# EAGLE design Mergen Ground Station_V2.0 (EAGLE 9.6.2)
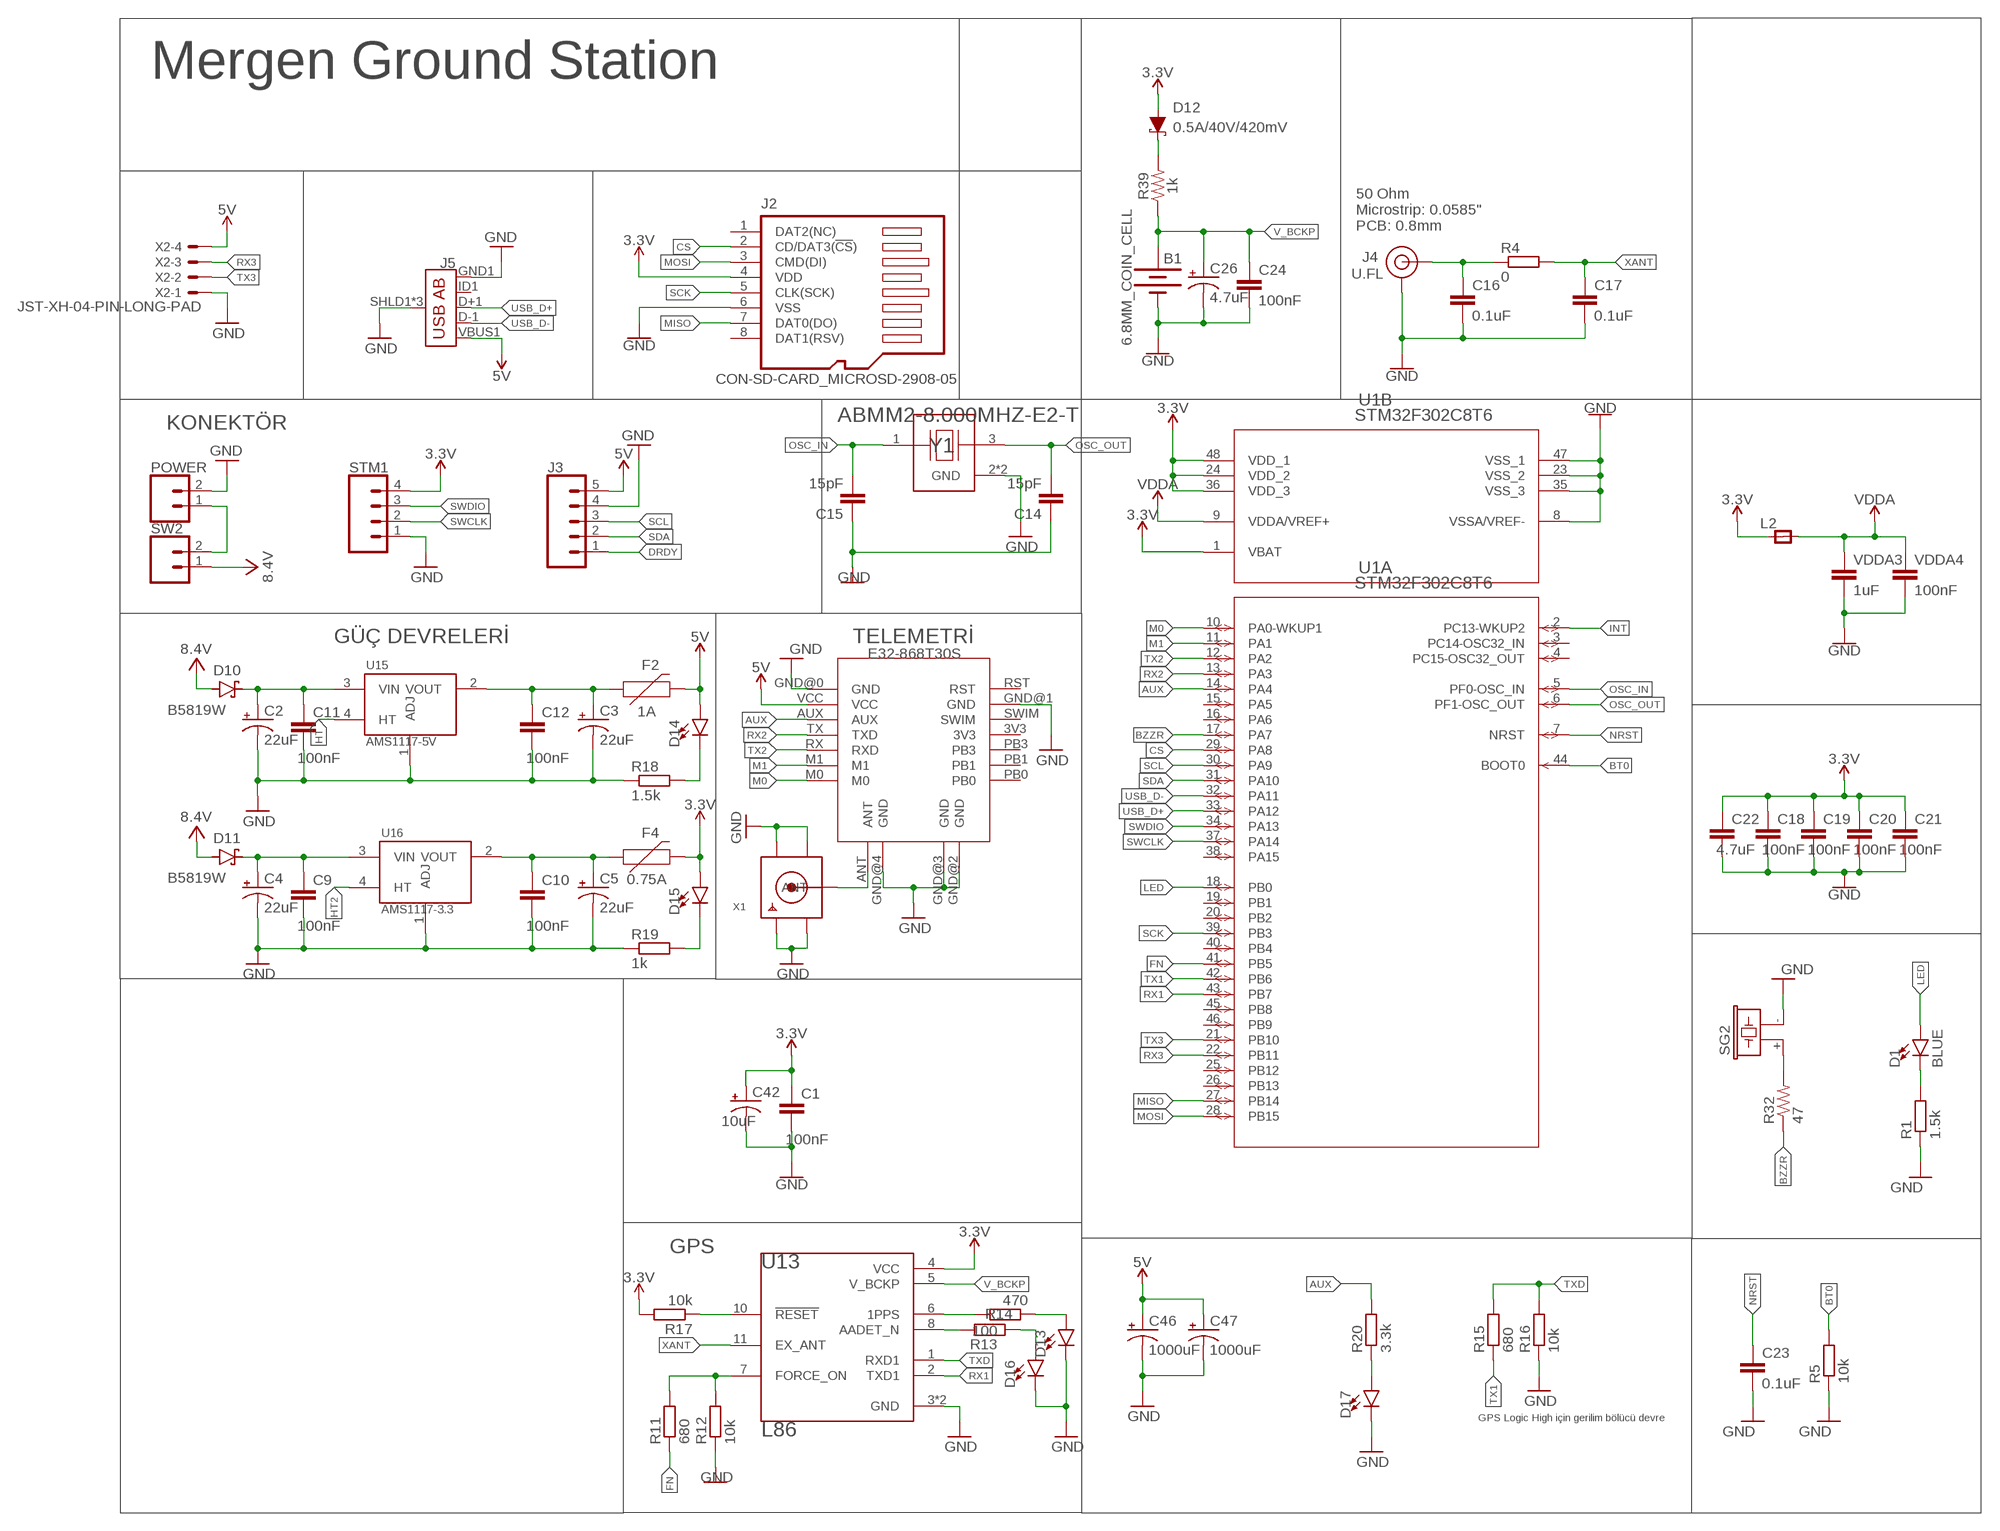
[diagram p0: schematic, sheet 1]

## Parts
B1  6.8MM_COIN_CELL  BATTERY-6.8MM_SMD  [BATTCON-6.8MM]
C1  100nF  C-EUC0603  [C0603]
C2  22uF  CPOL-USCT3528  [CT3528]
C3  22uF  CPOL-USCT3528  [CT3528]
C4  22uF  CPOL-USCT3528  [CT3528]
C5  22uF  CPOL-USCT3528  [CT3528]
C9  100nF  C-EUC0603  [C0603]
C10  100nF  C-EUC0603  [C0603]
C11  100nF  C-EUC0603  [C0603]
C12  100nF  C-EUC0603  [C0603]
C14  15pF  C-EUC0603  [C0603]
C15  15pF  C-EUC0603  [C0603]
C16  0.1uF  C-EUC0603  [C0603]
C17  0.1uF  C-EUC0603  [C0603]
C18  100nF  C-EUC0603  [C0603]
C19  100nF  C-EUC0603  [C0603]
C20  100nF  C-EUC0603  [C0603]
C21  100nF  C-EUC0603  [C0603]
C22  4.7uF  C-EUC0603  [C0603]
C23  0.1uF  C-EUC0603  [C0603]
C24  100nF  C-EUC0603  [C0603]
C26  4.7uF  CPOL-USA/3216-18R  [A/3216-18R]
C42  10uF  10UF-POLAR-EIA3216-16V-10%(TANT)  [EIA3216]
C46  1000uF  CPOL-US150CLZ-1010  [150CLZ-1010]
C47  1000uF  CPOL-US150CLZ-1010  [150CLZ-1010]
D1  BLUE  LED0603  [LED-0603]
D10  B5819W  SCHOTTKY_MBR0520LT1GDO-219  [SODFL3718X115]
D11  B5819W  SCHOTTKY_MBR0520LT1GDO-219  [SODFL3718X115]
D12  0.5A/40V/420mV  DIODE-SCHOTTKY-PMEG4005EJ  [SOD-323]
D13  LED0603  [LED-0603]
D14  LED0603  [LED-0603]
D15  LED0603  [LED-0603]
D16  LED0603  [LED-0603]
D17  LED0603  [LED-0603]
F2  1A  PPTC_HALF-AMP  [1206]
F4  0.75A  PPTC_HALF-AMP  [1206]
J2  CON-SD-CARD_MICROSD-2908-05  [CON-SD-CARD_2908-05]
J3  CONN_05LOCK_LONGPADS  [1X05_LOCK_LONGPADS]
J4  U.FL  U.FL2PIN  [U.FL]
J5  USB_AB_SMT  [USB-AB-MICRO-SMD]
L2  RC-MASTER-SMD_FB_0805MP  [RC-MASTER-SMD_L0805MP]
POWER  CONN_023.5MM-NO_SILK  [SCREWTERMINAL-3.5MM-2-NS]
R1  1.5k  R-EU_R0603  [R0603]
R4  0  R-EU_R0603  [R0603]
R5  10k  R-EU_R0603  [R0603]
R11  680  R-EU_R0603  [R0603]
R12  10k  R-EU_R0603  [R0603]
R13  100  R-EU_R0603  [R0603]
R14  470  R-EU_R0603  [R0603]
R15  680  R-EU_R0603  [R0603]
R16  10k  R-EU_R0603  [R0603]
R17  10k  R-EU_R0603  [R0603]
R18  1.5k  R-EU_R0603  [R0603]
R19  1k  R-EU_R0603  [R0603]
R20  3.3k  R-EU_R0603  [R0603]
R32  47  0OHM-0603-1/10W-5%  [0603]
R39  1k  1KOHM-0603-1/10W-1%  [0603]
SG2  F/CM12P  [F/CM12P]
STM1  CONN_04  [1X04]
SW2  CONN_023.5MM-NO_SILK  [SCREWTERMINAL-3.5MM-2-NS]
U1  STM32F302C8T6  [LQFP48-7X7MM]
U13  L86  [XCVR_L86]
U14  E32-868T30S  [E32-868T30S]
U15  AMS1117-5V  AMS1117-3.3  [SOT229P700X180-4N]
U16  AMS1117-3.3  [SOT229P700X180-4N]
VDDA3  1uF  0.1UF-0603-25V-(+80/-20%)  [0603]
VDDA4  100nF  0.1UF-0603-25V-(+80/-20%)  [0603]
X1  SMACONNECTOR  [SMA90_DIP]
X2  JST-XH-04-PIN-LONG-PAD  [JST-XH-04-PACKAGE-LONG-PAD]
Y1  ABMM2-8.000MHZ-E2-T  [XTAL_ABMM2-8.000MHZ-E2-T]

## Nets
3.3V: C1.1 C18.1 C19.1 C20.1 C21.1 C22.1 C42.+ D12.A D15.A F4.2 J2.4(VDD) L2.1 R17.2 STM1.4 U1.1(B:VBAT) U1.24(B:VDD_2) U1.36(B:VDD_3) U1.48(B:VDD_1) U13.4(VCC)
5V: C46.+ C47.+ D14.A F2.2 J3.5 J5.VBUS1(VBUS) U14.VCC X2.4
AUX: R20.2 U1.14(A:PA4) U14.AUX
BT0: R5.2 U1.44(A:BOOT0)
BZZR: R32.1 U1.17(A:PA7)
CS: J2.2(CD/DAT3(!CS!)) U1.29(A:PA8)
DRDY: J3.1
FN: R11.1 U1.41(A:PB5)
GND: B1.- C1.2 C2.- C3.- C4.- C5.- C9.2 C10.2 C11.2 C12.2 C14.1 C15.1 C16.2 C17.2 C18.2 C19.2 C20.2 C21.2 C22.2 C23.2 C24.2 C26.- C42.- C46.- C47.- D13.C D16.C D17.C J2.6(VSS) J3.4 J4.1(GND) J4.2(GND) J5.GND1(GND) J5.SHLD1(SHIELD) J5.SHLD2(SHIELD) J5.SHLD3(SHIELD) POWER.2 R1.1 R5.1 R12.1 R16.1 R18.1 R19.1 SG2.- STM1.1 U1.8(B:VSSA/VREF-) U1.23(B:VSS_2) U1.35(B:VSS_3) U1.47(B:VSS_1) U13.3(GND) U13.12(GND) U14.GND@0(GND) U14.GND@1(GND) U14.GND@2(GND) U14.GND@3(GND) U14.GND@4(GND) U15.1(ADJ) U16.1(ADJ) VDDA3.2 VDDA4.2 X1.GND1 X1.GND2 X1.GND3 X1.GND4 X2.1 Y1.2(GND) Y1.4(GND)
HT: U15.4(HT)
HT2: U16.4(HT)
INT: U1.2(A:PC13-WKUP2)
LED: D1.A U1.18(A:PB0)
M0: U1.10(A:PA0-WKUP1) U14.M0
M1: U1.11(A:PA1) U14.M1
MISO: J2.7(DAT0(DO)) U1.27(A:PB14)
MOSI: J2.3(CMD(DI)) U1.28(A:PB15)
N$1: D1.C R1.2
N$2: D16.A R13.1
N$22: C2.+ C11.1 D10.1(C) U15.3(VIN)
N$23: C3.+ C12.1 F2.1 U15.2(VOUT)
N$24: C4.+ C9.1 D11.1(C) U16.3(VIN)
N$25: C5.+ C10.1 F4.1 U16.2(VOUT)
N$27: U14.ANT X1.ANTENNA(ANT)
N$28: R32.2 SG2.+
N$30: POWER.1 SW2.2
N$31: D12.C R39.2
N$32: R17.1 U13.10(!RESET)
N$33: R14.2 U13.6(1PPS)
N$34: D13.A R14.1
N$35: D14.C R18.2
N$36: D15.C R19.2
N$37: R13.2 U13.8(AADET_N)
N$39: C16.1 J4.FEED(SIGNAL) R4.1
N$40: R11.2 R12.2 U13.7(FORCE_ON)
N$41: D17.A R20.1
NRST: C23.1 U1.7(A:NRST)
OSC_IN: C15.2 U1.5(A:PF0-OSC_IN) Y1.1
OSC_OUT: C14.2 U1.6(A:PF1-OSC_OUT) Y1.3
RX1: U1.43(A:PB7) U13.2(TXD1)
RX2: U1.13(A:PA3) U14.TX(TXD)
RX3: U1.22(A:PB11) X2.3
SCK: J2.5(CLK(SCK)) U1.39(A:PB3)
SCL: J3.3 U1.30(A:PA9)
SDA: J3.2 U1.31(A:PA10)
SWCLK: STM1.2 U1.37(A:PA14)
SWDIO: STM1.3 U1.34(A:PA13)
TX1: R15.1 U1.42(A:PB6)
TX2: U1.12(A:PA2) U14.RX(RXD)
TX3: U1.21(A:PB10) X2.2
TXD: R15.2 R16.2 U13.1(RXD1)
USB_D+: J5.D+1(D+) U1.33(A:PA12)
USB_D-: J5.D-1(D-) U1.32(A:PA11)
V_BCKP: B1.+ C24.1 C26.+ R39.1 U13.5(V_BCKP)
VCC: D10.2(A) D11.2(A) SW2.1 ; supply symbol labelled 8.4V
VDDA: L2.2 U1.9(B:VDDA/VREF+) VDDA3.1 VDDA4.1
XANT: C17.1 R4.2 U13.11(EX_ANT)
Unconnected: J2.1(DAT2(NC)) J2.8(DAT1(RSV)) J2.GND@1(GND) J2.GND@2(GND) J2.GND@3(GND) J2.GND@4(GND) J5.ID1(USBID) U1.3(A:PC14-OSC32_IN) U1.4(A:PC15-OSC32_OUT) U1.15(A:PA5) U1.16(A:PA6) U1.19(A:PB1) U1.20(A:PB2) U1.25(A:PB12) U1.26(A:PB13) U1.38(A:PA15) U1.40(A:PB4) U1.45(A:PB8) U1.46(A:PB9) U14.3V3 U14.PB0 U14.PB1 U14.PB3 U14.RST U14.SWIM

## Notes on the sheet
- Mergen Ground Station
- 50 Ohm 
  Microstrip: 0.0585"
  PCB: 0.8mm
- KONEKTÖR
- GÜÇ DEVRELERİ | TELEMETRİ
- GPS
- GPS Logic High için gerilim bölücü devre

## Library data of the parts
B1 = SparkFun-Batteries:BATTERY: Battery - Single Cell A variety of battery chemistries, sizes, and footprints. Device List: 20MM_PTH - Coin Cell Battery Holder - 20mm (PTH) <https://www.sparkfun.com/products/783> 6.8MM_PTH - Coin Cell Battery Holder - 6.8MM(SMD) <https://www.digikey.com/product-detail/en/seiko-instruments/MS621FE-FL11E/728-1057-ND/1889208?WT.srch=1&gclid=CNOQ5a6LzdQCFZS2wAodXCkE0g> 12MM_SMD - Coin Cell Battery Holder - 12mm (SMD) <https://www.sparkfun.com/products/10592> 12MM_PTH - Coin Cell Battery Holder - 12mm (PTH) <https://www.sparkfun.com/products/7948> 20MM_SMD - 20mm Coin Cell Battery Holder (SMD) (2 legs) Used on the Big Time Watch Kit <https://www.sparkfun.com/products/11734> 20MM_SMD_4LEGS - Coin Cell Battery Holder - 20mm (SMD) <https://www.sparkfun.com/products/11892> 20MM_SMD_4LEGS_OVERPASTE - Coin Cell Battery Holder - 20mm (SMD) <https://www.sparkfun.com/products/11892> (Over-paste on the legs) 24.5MM_PTH - Coin Cell Battery Holder - 24.5mm (PTH) <https://www.sparkfun.com/products/8863> 9V - 9V Battery Holder - PC Mount Used on the SparkFun SparkPunk Sound Kit <https://www.sparkfun.com/products/11177> and SparkFun SparkPunk Sequencer Kit <https://www.sparkfun.com/products/12707> 18650 - Battery Holder - 18650 (PTH) <https://www.sparkfun.com/products/13113> AA - Battery Holder - 1xAA (PTH) <https://www.sparkfun.com/products/7949> AAA - Battery Holder - 1xAAA (PTH) <https://www.sparkfun.com/products/12718> AA_KIT - Battery Holder - 1xAA (PTH) <https://www.sparkfun.com/products/7949> Special kit package - pads only have exposed copper on one side of the board. AAA_KIT - Battery Holder - 1xAAA (PTH) <https://www.sparkfun.com/products/12718> Special kit package - pads only have exposed copper on one side of the board.; PROD_ID: BATT-13734
C1 C9-C12 C14-C24 = rcl:C-EU: CAPACITOR, European symbol; SPICEPREFIX: C
C2-C5 C26 = rcl:CPOL-US: POLARIZED CAPACITOR, American symbol; SPICEPREFIX: C
C42 = SparkFun-Capacitors:10UF-POLAR: 10.0µF polarized capacitors A capacitor is a passive two-terminal electrical component used to store electrical energy temporarily in an electric field.; PROD_ID: CAP-00811
C46 C47 = adafruit:CPOL-US: POLARIZED CAPACITOR, American symbol
D1 D13-D17 = SparkFun-LED:LED: LED (Generic) Standard schematic elements and footprints for 5mm, 3mm, 1206, and 0603 sized LEDs. Generic LEDs with no color specified.
D10 D11 = Diode:SCHOTTKY_: Schottky Diode - Popular parts; CATEGORY: Diode; DESCRIPTION: DIODE SCHOTTKY 20V 500MA SOD123; MANUFACTURER: ON Semiconductor; MPN: MBR0520LT1G; SUB-CATEGORY: Schottky; VALUE: MBR0520LT1G
D12 = SparkFun-DiscreteSemi:DIODE-SCHOTTKY: Schottky diode A Schottky diode is a semiconductor diode which has a low forward voltage drop and a very fast switching action.; PROD_ID: DIO-10955
F2 F4 = SparkFun-Fuses:PPTC: Resettable Fuse PPTC Resettable Fuse. Really a sort of resistor with a polymeric positive temperature coefficient whose resistance increases dramatically with an increase in temperature. When heated by the power passing through the resistance rises causing the current to be limited, protecting the circuit. This is achieved by the transition of the polymer from a crystalline to an amorphous state where the conductive carbon separates breaking the conductive pathways found in the cool crystalline structure. When a PPTC cools back down it resumes conducting letting the circuit turn back on. SparkFun Products: SparkFun RedBoard - Programmed with Arduino <https://www.sparkfun.com/products/12757> Pro Micro - 5V/16MHz <https://www.sparkfun.com/products/12640> Arduino Pro 328 - 5V/16MHz <https://www.sparkfun.com/products/10915> MP3 Trigger <https://www.sparkfun.com/products/13720>; PROD_ID: RES-08585; VALUE: 6V/0.5A
J2 = 52101-101-REV-A_v16:CON-SD-CARD_MICROSD-: microSD Connector
J3 = SparkFun-Connectors:CONN_05: Multi connection point. Often used as Generic Header-pin footprint for 0.1 inch spaced/style header connections On any of the 0.1 inch spaced packages, you can populate with these: Break Away Headers - Straight <https://www.sparkfun.com/products/116> (PRT-00116) Break Away Male Headers - Right Angle <https://www.sparkfun.com/products/553> (PRT-00553) Female Headers <https://www.sparkfun.com/products/115> (PRT-00115) Break Away Headers - Machine Pin <https://www.sparkfun.com/products/117> (PRT-00117) Break Away Female Headers - Swiss Machine Pin <https://www.sparkfun.com/products/743> (PRT-00743) For SCREWTERMINALS and SPRING TERMINALS visit here: Screw Terimnals on SparkFun.com <https://www.sparkfun.com/search/results?term=Screw+Terminals> (5mm/3.5mm/2.54mm spacing) This device is also useful as a general connection point to wire up your design to another part of your project. Our various solder wires solder well into these plated through hole pads. Hook-Up Wire - Assortment (Stranded, 22 AWG) <https://www.sparkfun.com/products/11375> (PRT-11375) Hook-Up Wire - Assortment (Solid Core, 22 AWG) <https://www.sparkfun.com/products/11367> (PRT-11367) View the entire wire category on our website here <https://www.sparkfun.com/categories/141> Special notes: Molex polarized connector foot print use with SKU : PRT-08231 with associated crimp pins and housings. 1MM SMD Version SKU: PRT-10208
J4 = SparkFun-Connectors:U.FL2PIN: SMD Antenna Connector - U.FL 2mm height, 3.0mm x 3.0mm receptacle size. SparkFun Products: SparkFun WiFi Shield - ESP8266 <https://www.sparkfun.com/products/13287> SparkFun ESP8266 Thing <https://www.sparkfun.com/products/13231> SparkFun MiniGen - Pro Mini Signal Generator Shield <https://www.sparkfun.com/products/11420>; PROD_ID: CONN-09193; SF_ID: WRL-09144
J5 = SparkFun-Connectors:USB_AB: USB Type AB Micro Connector OTG-compatible. 5 pins, 3 shield pins SparkFun Products: IOIO-OTG <https://www.sparkfun.com/products/13613> SparkFun SAMD21 Mini Breakout <https://www.sparkfun.com/products/13664>; PROD_ID: CONN-11794
L2 = 52101-101-REV-A_v16:RC-MASTER-SMD_FB_: FERRITE BEAD
POWER SW2 = SparkFun-Connectors:CONN_02: Multi connection point. Often used as Generic Header-pin footprint for 0.1 inch spaced/style header connections On any of the 0.1 inch spaced packages, you can populate with these: Break Away Headers - Straight <https://www.sparkfun.com/products/116> (PRT-00116) Break Away Male Headers - Right Angle <https://www.sparkfun.com/products/553> (PRT-00553) Female Headers <https://www.sparkfun.com/products/115> (PRT-00115) Break Away Headers - Machine Pin <https://www.sparkfun.com/products/117> (PRT-00117) Break Away Female Headers - Swiss Machine Pin <https://www.sparkfun.com/products/743> (PRT-00743) For SCREWTERMINALS and SPRING TERMINALS visit here: Screw Terimnals on SparkFun.com <https://www.sparkfun.com/search/results?term=Screw+Terminals> (5mm/3.5mm/2.54mm spacing) This device is also useful as a general connection point to wire up your design to another part of your project. Our various solder wires solder well into these plated through hole pads. Hook-Up Wire - Assortment (Stranded, 22 AWG) <https://www.sparkfun.com/products/11375> (PRT-11375) Hook-Up Wire - Assortment (Solid Core, 22 AWG) <https://www.sparkfun.com/products/11367> (PRT-11367) View the entire wire category on our website here <https://www.sparkfun.com/categories/141> Special notes: Molex polarized connector foot print use with: PRT-08233 with associated crimp pins and housings. 2.54_SCREWTERM for use with PRT-10571. 3.5mm Screw Terminal footprints for PRT-08084 5mm Screw Terminal footprints for use with PRT-08432; PROD_ID: CONN-08399
R1 R4 R5 R11-R20 = rcl:R-EU_: RESISTOR, European symbol; SPICEPREFIX: R
R32 = SparkFun-Resistors:0OHM: 0Ω resistor A resistor is a passive two-terminal electrical component that implements electrical resistance as a circuit element. Resistors act to reduce current flow, and, at the same time, act to lower voltage levels within circuits. - Wikipedia; PROD_ID: RES-08609; VALUE: 0
R39 = SparkFun-Resistors:1KOHM: 1kΩ resistor A resistor is a passive two-terminal electrical component that implements electrical resistance as a circuit element. Resistors act to reduce current flow, and, at the same time, act to lower voltage levels within circuits. - Wikipedia; PROD_ID: RES-07856
SG2 = buzzer:F/CM12P: BUZZER Source: Buerklin; OC_FARNELL: unknown; OC_NEWARK: unknown
STM1 = SparkFun-Connectors:CONN_04: Multi connection point. Often used as Generic Header-pin footprint for 0.1 inch spaced/style header connections On any of the 0.1 inch spaced packages, you can populate with these: Break Away Headers - Straight <https://www.sparkfun.com/products/116> (PRT-00116) Break Away Male Headers - Right Angle <https://www.sparkfun.com/products/553> (PRT-00553) Female Headers <https://www.sparkfun.com/products/115> (PRT-00115) Break Away Headers - Machine Pin <https://www.sparkfun.com/products/117> (PRT-00117) Break Away Female Headers - Swiss Machine Pin <https://www.sparkfun.com/products/743> (PRT-00743) For SCREWTERMINALS and SPRING TERMINALS visit here: Screw Terimnals on SparkFun.com <https://www.sparkfun.com/search/results?term=Screw+Terminals> (5mm/3.5mm/2.54mm spacing) This device is also useful as a general connection point to wire up your design to another part of your project. Our various solder wires solder well into these plated through hole pads. Hook-Up Wire - Assortment (Stranded, 22 AWG) <https://www.sparkfun.com/products/11375> (PRT-11375) Hook-Up Wire - Assortment (Solid Core, 22 AWG) <https://www.sparkfun.com/products/11367> (PRT-11367) View the entire wire category on our website here <https://www.sparkfun.com/categories/141> Special notes: Molex polarized connector foot print use with SKU : PRT-08231 with associated crimp pins and housings. 1MM SMD Version SKU: PRT-10208; PROD_ID: CONN-09696
U1 = STM32F302C8T6:STM32F302C8T6; BUILT_BY: EMA_UL_Team; COPYRIGHT: Copyright (C) 2018 Accelerated Designs. All rights reserved; MANUFACTURER_PART_NUMBER: STM32F302C8T6; SOURCELIBRARY: Updates_to_database_2020-10-19; VENDOR: STMicroelectronics
U13 = L86:L86: L86 is an ultra-compact GNSS POT (Patch on Top) module with an embedded 18.4mm × 18.4mm × 4.0mm patch antenna and utilizes the MediaTek new generation GNSS chipset MT3333 that achieves the perfect performance; AVAILABILITY: Unavailable; DESCRIPTION: L86 is an ultra-compact GNSS POT (Patch on Top) module with an embedded 18.4mm × 18.4mm × 4.0mm patch antenna and utilizes the MediaTek new generation GNSS chipset MT3333 that achieves the perfect performance; MF: Quectel; MP: L86; PACKAGE: PowerSFN-8 Quectel; PRICE: None
U14 = E32-868T30S:E32-868T30S: E BYTE E32-868T30S
U15 U16 = AMS1117-3.3:AMS1117-3.3: Sot223/Pkg 1-Amp 3.3-Volt Low Drop Out Voltage Regulatator; AVAILABILITY: Unavailable; DESCRIPTION: Sot223/Pkg 1-Amp 3.3-Volt Low Drop Out Voltage Regulatator; MF: Advanced Monolithic Systems; MP: AMS1117-3.3; PACKAGE: SOT-89 ams; PRICE: None
VDDA3 VDDA4 = SparkFun-Capacitors:0.1UF: 0.1µF ceramic capacitors A capacitor is a passive two-terminal electrical component used to store electrical energy temporarily in an electric field.; PROD_ID: CAP-00810; VALUE: 0.1uF
X1 = adafruit:SMACONNECTOR: SMA Connector 90° DIP SMA Connector, 50 Ohm (4UConnector: 07259)
X2 = Rembrandt Electronics - JST XH Connectors v1-0:JST-XH-04-PIN: JST XH Connector 2 Pin Wire to board connector. Pitch: 2,54 mm, (0.100") Number of pins: 4 Created by Rembrandt Electronics www.rembrandtelectronics.com
Y1 = ABMM2-8.000MHZ-E2-T (1):ABMM2-8.000MHZ-E2-T: Check prices <https://pricing.snapeda.com/parts/ABMM2-8.000MHZ-E2-T/Abracon/view-part?ref=eda>; AVAILABILITY: Good; DESCRIPTION: 8MHz ±20ppm Crystal 18pF 72 Ohms 4-SMD, No Lead; MF: Abracon; MP: ABMM2-8.000MHZ-E2-T; PACKAGE: SMD-4 Abracon; PRICE: None; PURCHASE-URL: https://pricing.snapeda.com/search/part/ABMM2-8.000MHZ-E2-T/?ref=eda

## Board
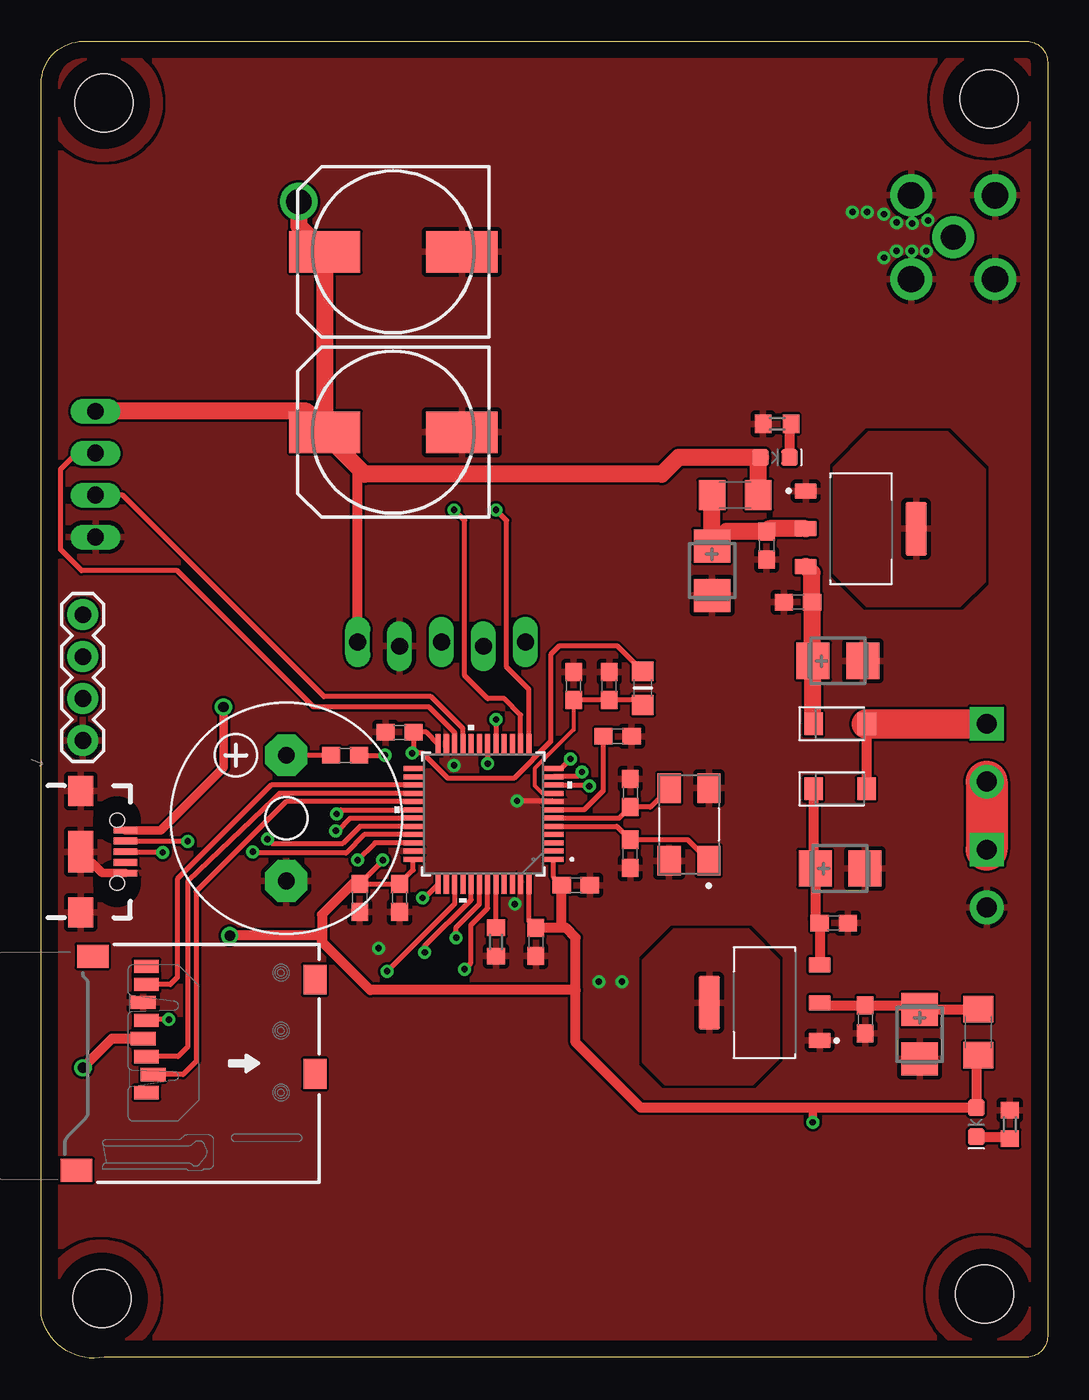
[diagram p1: board, top side]
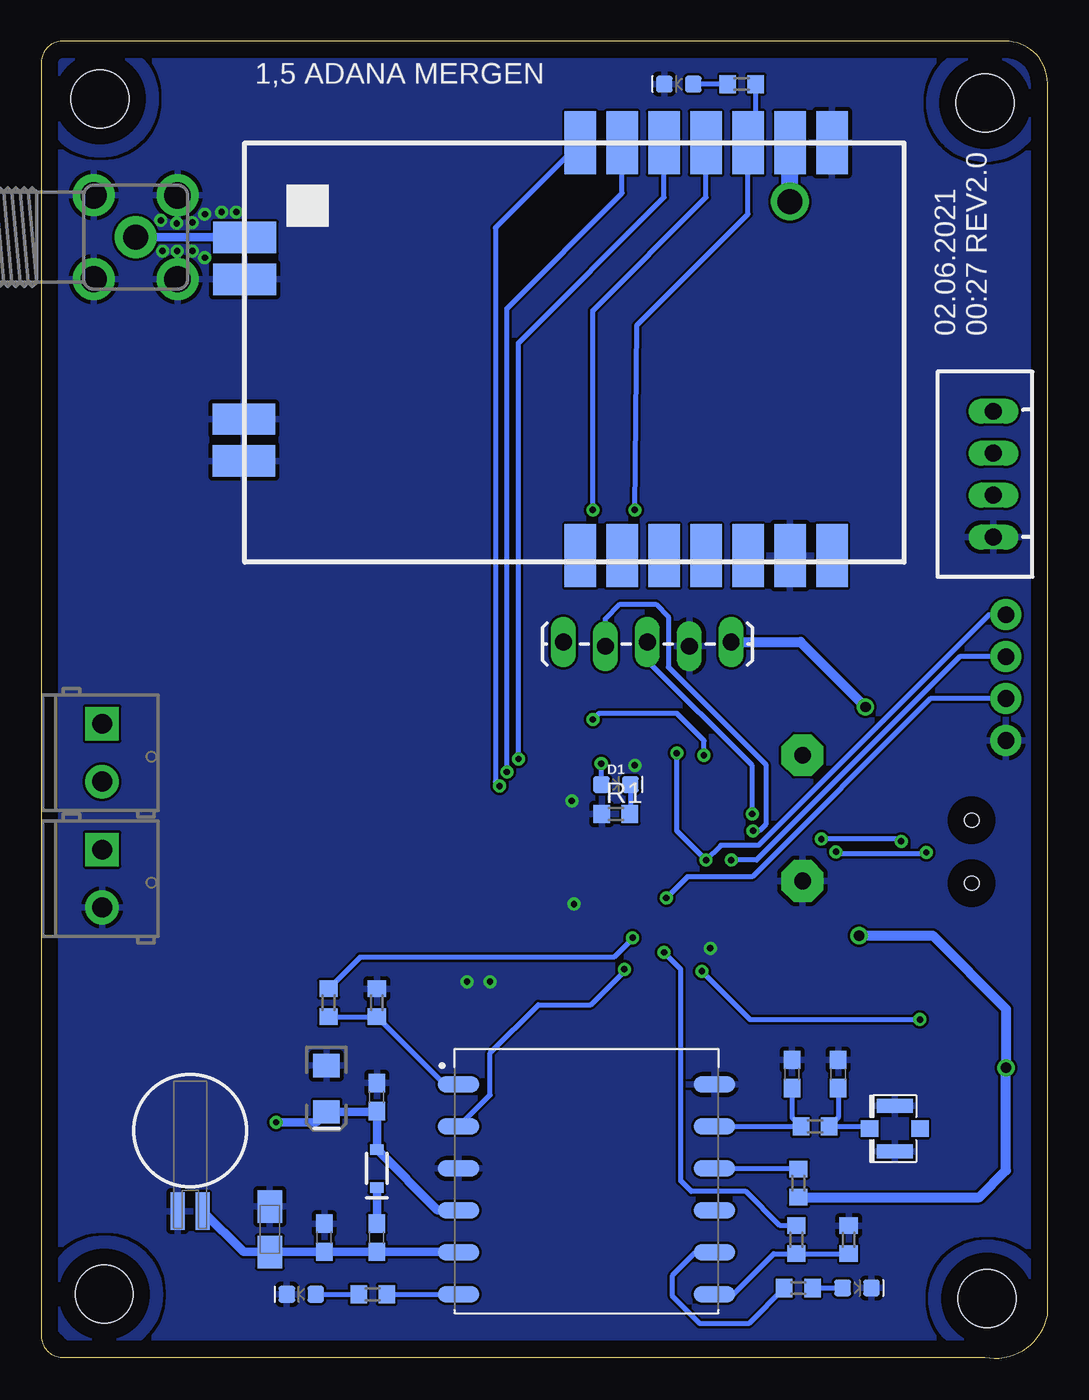
[diagram p2: board, bottom side, seen from below]

Size 60.94 x 79.74 mm. Coordinates in mm from the lower left corner, seen from the top.
Outline: 60.94,78.47 60.94,1.33 arc-90 59.67,0.06 3.81,0.06 arc-90 0,2.6 0,77.2 arc-90 2.54,79.74 59.67,79.74 arc-90 60.94,78.47
Copper layers (1*16): Top 0.035mm / dielectric 1.5mm / Bottom 0.035mm
Design rules "default": minimum track width 6mil, minimum drill 0.35mm, track to track 6mil, track to pad 6mil, pad to pad 6mil, via to via 6mil, smd to smd 6mil, copper to edge 40mil, drill to drill 6mil, minimum pad ring 10mil, minimum via ring 8mil, stop-mask expansion 4mil, vias tented up to drill 0mil, thermal gap 10mil
Holes 3.5 mm at 3.79,76.01 57.38,76.26 3.66,3.62 57.13,3.87

### Footprints (pad centres in the part's own frame; a part is rotated, then mirrored left to right if it is on the bottom)
BATTCON-6.8MM = smd 2.25 x 0.85: + 4.87,0.75; - 4.87,-0.75
C0603 = smd 1.1 x 1: 1 -0.85,0; 2 0.85,0
CT3528 = smd 2 x 2.2: + -1.5,0; - 1.5,0
A/3216-18R = smd 1.95 x 1.5: + 1.375,0; - -1.375,0
EIA3216 = smd 1.4 x 1.6: + 1.4,0; - -1.4,0
150CLZ-1010 = smd 4.3 x 2.5: + 4.15,0; - -4.15,0
LED-0603 = smd 1 x 1: A -0.877,0; C 0.877,0
SODFL3718X115 = smd 1.115 x 1.361: 1 -1.6,0; 2 1.6,0
SOD-323 = smd 0.63 x 0.83: A 1.15,0; C -1.15,0
1206 = smd 1.6 x 1.8: 1 -1.4,0; 2 1.4,0
CON-SD-CARD_2908-05 = smd 0.8 x 1.5: 1 1.761,3.847; 2 0.669,4.253; 3 -0.423,3.847; 4 -1.515,3.644; 5 -2.607,3.847; 6 -3.7,3.644; 7 -4.792,3.847; 8 -5.884,3.847 | smd 1.397 x 1.905: GND@1 -6.5,0.6; GND@2 6.473,-0.389 | smd 1.803 x 1.397: GND@3 0.631,14.059; GND@4 -5.084,14.059
1X05_LOCK_LONGPADS = drill 1.016 long: 1 0,0; 2 2.54,-0.254; 3 5.08,0; 4 7.62,-0.254; 5 10.16,0
U.FL = smd 2.2 x 0.85: 1 0,1.375; 2 0,-1.375 | smd 1.05 x 1: FEED 1.525,0; NC -1.525,0
USB-AB-MICRO-SMD = smd 1.4 x 0.4: D+1 2.7,0; D-1 2.7,0.65; GND1 2.7,-1.3; ID1 2.7,-0.65; VBUS1 2.7,1.3 | smd 1.5 x 1.8: SHLD1 0,-3.68; SHLD2 0,3.68 | smd 1.5 x 2.5: SHLD3 0,0 | hole 0.85: 2.2,1.9; 2.2,-1.9
RC-MASTER-SMD_L0805MP = smd 1.2 x 1.3: 1 -1.016,0; 2 1.016,0
SCREWTERMINAL-3.5MM-2-NS = drill 1.2 pad 2.032 square: 1 0,0 | drill 1.2 pad 2.032: 2 3.5,0
R0603 = smd 1 x 1.1: 1 -0.85,0; 2 0.85,0
0603 = smd 1.1 x 1: 1 -0.85,0; 2 0.85,0
F/CM12P = drill 1.016 pad 2.54 octagon: + 3.81,0; - -3.81,0
1X04 = drill 1.016 pad 1.88: 1 0,0; 2 2.54,0; 3 5.08,0; 4 7.62,0
LQFP48-7X7MM = smd 1.194 x 0.305: 1 -4.25,2.75; 2 -4.25,2.25; 3 -4.25,1.75; 4 -4.25,1.25; 5 -4.25,0.75; 6 -4.25,0.25; 7 -4.25,-0.25; 8 -4.25,-0.75; 9 -4.25,-1.25; 10 -4.25,-1.75; 11 -4.25,-2.25; 12 -4.25,-2.75; 25 4.25,-2.75; 26 4.25,-2.25; 27 4.25,-1.75; 28 4.25,-1.25; 29 4.25,-0.75; 30 4.25,-0.25; 31 4.25,0.25; 32 4.25,0.75; 33 4.25,1.25; 34 4.25,1.75; 35 4.25,2.25; 36 4.25,2.75 | smd 0.305 x 1.194: 13 -2.75,-4.25; 14 -2.25,-4.25; 15 -1.75,-4.25; 16 -1.25,-4.25; 17 -0.75,-4.25; 18 -0.25,-4.25; 19 0.25,-4.25; 20 0.75,-4.25; 21 1.25,-4.25; 22 1.75,-4.25; 23 2.25,-4.25; 24 2.75,-4.25; 37 2.75,4.25; 38 2.25,4.25; 39 1.75,4.25; 40 1.25,4.25; 41 0.75,4.25; 42 0.25,4.25; 43 -0.25,4.25; 44 -0.75,4.25; 45 -1.25,4.25; 46 -1.75,4.25; 47 -2.25,4.25; 48 -2.75,4.25
XCVR_L86 = smd 2.5 x 1: 1 -7.75,6.35; 2 -7.75,3.81; 3 -7.75,1.27; 4 -7.75,-1.27; 5 -7.75,-3.81; 6 -7.75,-6.35; 7 7.75,-6.35; 8 7.75,-3.81; 9 7.75,-1.27; 10 7.75,1.27; 11 7.75,3.81; 12 7.75,6.35
E32-868T30S = smd 3.81 x 1.905: 3V3 12.3,5.08; AUX -12.7,7.62; GND@0 -12.7,12.7; GND@1 12.3,10.16; M0 -12.7,-2.54; M1 -12.7,0; PB0 12.3,-2.54; PB1 12.3,0; PB3 12.3,2.54; RST 12.3,12.7; RX -12.7,2.54; SWIM 12.3,7.62; TX -12.7,5.08; VCC -12.7,10.16 | smd 1.905 x 3.81: ANT -6.97,-22.86; GND@2 6.57,-22.91; GND@3 4.03,-22.91; GND@4 -4.43,-22.86
SOT229P700X180-4N = smd 0.93 x 1.31: 1 -2.29,-3.345; 2 0,-3.345; 3 2.29,-3.345 | smd 3.24 x 1.31: 4 0,3.345
SMA90_DIP = drill 1.5 pad 2.54: ANTENNA 0,0 | drill 1.6 pad 2.54: GND1 -2.54,2.54; GND2 2.54,2.54; GND3 -2.54,-2.54; GND4 2.54,-2.54
JST-XH-04-PACKAGE-LONG-PAD = drill 1.016 long: 1 -3.81,0; 2 -1.27,0; 3 1.27,0; 4 3.81,0
XTAL_ABMM2-8.000MHZ-E2-T = smd 1.8 x 1.4: 1 -2.2,-1.2; 2 2.2,-1.2; 3 2.2,1.2; 4 -2.2,1.2

### Placement (x,y rotation side)
B1  51.92,13.78 270 bottom
C1  40.62,15.81 90 bottom
C2  48.24,42.23 0 top
C3  40.62,47.69 270 top
C4  48.37,29.65 0 top
C5  53.19,19.62 270 top
C9  47.99,26.35 0 top
C10  49.89,20.51 270 top
C11  45.83,45.78 180 top
C12  43.92,49.21 270 top
C14  35.67,34.23 270 top
C15  35.67,30.54 90 top
C16  12.68,17.21 90 bottom
C17  15.47,17.21 90 bottom
C18  29.95,25.21 270 top
C19  21.7,37.91 180 top
C20  32.37,28.64 0 top
C21  21.7,27.88 270 top
C22  19.28,27.88 270 top
C23  34.91,37.65 0 top
C24  43.8,7.3 90 bottom
C26  47.1,7.81 270 bottom
C42  43.67,16.32 270 bottom
C46  21.32,66.99 180 top
C47  21.32,56.07 180 top
D1  26.14,34.73 0 bottom
D10  48.37,38.42 0 top
D11  48.37,34.48 0 top
D12  40.62,11.49 90 bottom
D13  45.19,3.87 180 bottom
D14  44.43,54.55 0 top
D15  56.62,14.29 270 top
D16  11.54,4.25 0 bottom
D17  22.33,77.15 180 bottom
F2  42.02,52.26 0 top
F4  56.75,19.75 270 top
J2  2.52,17.84 270 top
J3  29.32,43.37 0 bottom
J4  9.25,13.91 180 bottom
J5  2.39,30.67 0 top
L2  36.43,40.58 270 top
POWER  57.26,30.8 270 bottom
R1  26.14,32.96 0 bottom
R4  14.08,14.03 180 bottom
R5  27.54,25.21 90 top
R11  15.22,7.17 270 bottom
R12  12.04,7.17 270 bottom
R13  15.09,4.25 180 bottom
R14  40.87,3.87 0 bottom
R15  43.54,21.53 270 bottom
R16  40.62,21.53 270 bottom
R17  15.09,10.6 270 bottom
R18  44.56,56.58 0 top
R19  58.65,14.16 270 top
R20  18.52,77.15 0 bottom
R32  18.39,36.51 180 top
R39  40.62,7.3 90 bottom
SG2  14.84,32.7 90 top
STM1  2.52,37.4 90 top
SW2  57.26,38.42 270 bottom
U1  26.78,32.96 180 top
U13  27.92,10.22 0 bottom
U14  25.76,60.9 270 bottom
U15  49.64,50.23 270 top
U16  43.8,21.53 90 top
VDDA3  34.4,40.7 90 top
VDDA4  32.24,40.7 90 top
X1  55.23,67.88 90 bottom
X2  3.28,53.53 90 bottom
Y1  39.22,32.32 90 top

### Tracks (layer width: path | path; a pad name or v marks a point on that pad's centre or on a via)
3.3V  (via drill 0.38, 0.64)
  Top 0.305: U1.24 23.32,37.91 22.59,37.91 | 22.59,37.91 C19.1 | C20.1 31.03,29.13 U1.1 | C18.1 29.53,26.48 U1.48 | U1.36 22.53,29.56 C21.1 C22.1 20.68,30.12 v20.68,30.16 | 22.59,37.91 22.59,36.77 v22.46,36.64 23.09,36.64 24.62,35.11 28.62,35.11 30.84,37.33 30.84,42.61 31.35,43.12 34.91,43.12 L2.1
  Top 0.508: v46.72,14.29 46.72,15.16
  Top 0.61: F4.2 56.62,18.22 D15.A 46.72,15.16 36.31,15.16 32.37,19.11 32.37,22.29 | 32.37,22.29 32.37,25.46 31.77,26.06 31.35,26.06 | 31.35,26.06 C18.1 | 31.35,26.06 31.51,26.22 C20.1 | 32.37,22.29 19.92,22.29 17,25.21 17,25.59 | C22.1 18.86,28.73 17,26.86 17,25.59 | v2.52,17.59 4.29,19.36 J2.4 | 17,25.59 v11.41,25.59
  Bottom 0.305: STM1.4 3.54,45.02 17.51,31.05 19.79,31.05 v20.68,30.16 22.46,31.94 v22.46,36.64
  Bottom 0.508: U13.4 36.93,8.95 D12.A C1.1 40.66,14.92 C42.+ 44.3,14.29 v46.72,14.29
  Bottom 0.61: R17.2 4.13,9.75 2.52,11.37 v2.52,17.59 2.52,21.14 6.96,25.59 v11.41,25.59
5V  (via drill 0.64, 1.52)
  Top 0.508: J5.VBUS1 7.22,31.97 11.03,35.78 v11.03,39.43
  Top 0.61: 43.42,54.41 D14.A | J3.5 19.16,53.95 19.05,54.06
  Top 1.016: F2.2 43.42,54.41 | D14.A 38.6,54.55 37.58,53.53 19.58,53.53 19.05,54.06 17.17,55.94 C47.+ | C47.+ C46.+ 15.6,68.56 v15.6,70.04 | X2.4 16.06,57.34 17.17,56.23 C47.+
  Bottom 0.61: J3.5 14.97,43.37 v11.03,39.43
  Bottom 1.016: v15.6,70.04 U14.VCC
AUX  (via drill 0.38)
  Top 0.305: U1.14 29.03,38.96 28.05,39.94 27.03,39.94 25.63,41.34 25.63,50.74 v25,51.37
  Bottom 0.305: v25,51.37 24.87,62.55 18.14,69.28 U14.AUX 18.14,73.63 17.67,74.1 R20.2
BT0
  Top 0.305: R5.2 27.54,28.69 U1.44
BZZR  (via drill 0.38)
  Top 0.305: R32.1 v20.81,36.51 | v27.54,38.67 27.54,37.22 U1.17
  Bottom 0.305: v20.81,36.51 20.81,37.4 22.46,39.05 27.16,39.05 v27.54,38.67
CS
  Top 0.305: U1.29 14.83,33.71 9.38,28.26 9.38,17.97 8.58,17.17 J2.2
D1
  pour Bottom: 60.89,76.26 arc90 57.36,79.77 arc90 53.88,76.24 arc90 57.38,72.76 arc90
  pour Top: 53.88,76.29 arc-90 57.36,79.77 arc-90 60.89,76.24 arc-90 57.33,72.76 arc-90
D2
  pour Bottom: 7.3,76.01 arc90 3.76,79.51 arc90 0.28,75.98 arc90 3.79,72.5 arc90
  pour Top: 0.28,76.03 arc-90 3.76,79.51 arc-90 7.3,75.98 arc-90 3.74,72.5 arc-90
D3
  pour Bottom: 7.17,3.62 arc90 3.64,7.12 arc90 0.16,3.59 arc90 3.66,0.11 arc90
  pour Top: 0.16,3.64 arc-90 3.64,7.12 arc-90 7.17,3.59 arc-90 3.61,0.11 arc-90
D4
  pour Bottom: 60.64,3.87 arc90 57.1,7.38 arc90 53.62,3.85 arc90 57.13,0.37 arc90
  pour Top: 53.62,3.9 arc-90 57.1,7.38 arc-90 60.64,3.85 arc-90 57.08,0.37 arc-90
FN  (via drill 0.38)
  Top 0.305: v23.22,24.57 23.22,24.95 26.03,27.76 U1.41
  Bottom 0.305: R11.1 16.2,8.02 18.27,10.1 21.57,10.1 22.2,10.73 22.2,23.56 v23.22,24.57
GND  (via drill 0.38)
  Top 0.305: U1.8 30.99,33.74 30.16,33.74 v28.81,33.74
  Top 0.508: J5.GND1 3.69,29.37 J5.SHLD3
  other vias: 51.8,68.77 51.03,69.28 50.02,69.4 49.13,69.4 52.74,68.72 53.7,68.9 53.6,67.04 52.71,67.04 51.8,67.04 51.03,66.64 28.68,27.49 20.43,24.83 25,35.9 35.16,22.8 33.76,22.8
  pour Top (rank 2): 61.19,80.45 -0.53,80.45 -0.53,-0.7 61.19,-0.7
  pour Bottom (rank 2): 62.34,81.34 62.34,-1.21 -1.16,-1.21 -1.16,81.34
HT
  pour Top: 48.11,47.56 50.02,45.66 55.61,45.66 57,47.05 57,53.78 54.84,55.94 50.15,55.94 48.11,53.91
HT2
  pour Top: 44.56,18.22 44.56,24.07 42.78,25.84 38.33,25.84 36.56,24.07 36.56,17.97 37.83,16.7 43.03,16.7
LED  (via drill 0.38)
  Top 0.305: U1.18 v27.03,36
  Bottom 0.305: v27.03,36 27.03,34.75 D1.A
M0  (via drill 0.38)
  Top 0.305: U1.10 33.13,34.71 v33.19,34.64
  Bottom 0.305: v33.19,34.64 33.45,34.9 33.45,68.45 U14.M0
M1  (via drill 0.38)
  Top 0.305: U1.11 31.07,35.25 32.5,35.25 v32.75,35.5
  Bottom 0.305: v32.75,35.5 32.75,63.56 25.76,70.55 U14.M1
MISO
  Top 0.305: U1.27 13.92,34.71 8.23,29.02 8.23,23.05 7.82,22.63 J2.7
MOSI
  Top 0.305: J2.3 8.28,18.27 8.87,18.86 8.87,28.88 14.06,33.84 14.42,34.21 U1.28
N$1
  Bottom 0.305: D1.C 25.27,32.98 R1.2
N$2
  Bottom 0.305: R13.1 D16.A
N$22
  Top 0.61: D10.1 46.74,38.44 | C2.+ 46.68,42.29
  Top 1.016: 46.74,38.44 C2.+ | 46.68,42.29 C11.1 46.68,47.55 U15.3
N$23
  Top 0.61: 44.09,50.23 C12.1 | 41.49,50.06 C3.+ | F2.1
  Top 1.016: U15.2 44.09,50.23 | C12.1 41.49,50.06 | C3.+ F2.1
N$24
  Top 0.61: D11.1 46.77,29.75 C4.+ 46.87,26.62 C9.1 U16.3
N$25
  Top 0.61: U16.2 47.31,21.36 C10.1 52.95,21.36 C5.+ 56.72,21.12 F4.1
N$27
  Bottom 0.508: X1.ANTENNA 48.64,67.88 U14.ANT
N$28
  Top 0.305: R32.2 SG2.+
N$30
  Top 2.54: SW2.2 POWER.1
N$31
  Bottom 0.508: R39.2 D12.C
N$32
  Bottom 0.305: U13.10 15.13,11.49 R17.1
N$33
  Bottom 0.305: R14.2 U13.6
N$34
  Bottom 0.305: D13.A R14.1
N$35
  Top 0.61: R18.2 45.31,56.48 D14.C
N$36
  Top 0.61: D15.C 58.55,13.41 R19.2
N$37
  Bottom 0.305: R13.2 18.1,2.09 21.06,2.09 22.71,3.75 22.71,5.02 21.32,6.41 U13.8
N$39
  Bottom 0.305: J4.FEED 10.9,14.03 R4.1 12.68,14.58 C16.1
N$40
  Bottom 0.305: U13.7 19.03,3.87 16.58,6.32 R11.2 R12.2
N$41
  Bottom 0.305: R20.1 D17.A
NRST
  Top 0.305: U1.7 32.87,33.21 34.02,34.35 34.02,37.62 C23.1
OSC_IN
  Top 0.305: U1.5 34.85,32.21 C15.2 39.15,31.39 Y1.1
OSC_OUT
  Top 0.305: U1.6 35,32.71 C14.2 36.88,33.38 Y1.3
RX1  (via drill 0.38)
  Top 0.305: v25.63,23.56 26.02,23.94 26.02,26.22 27.03,27.24 U1.43
  Bottom 0.305: U13.2 33.76,15.94 33.76,18.48 30.84,21.4 27.67,21.4 25.63,23.43 v25.63,23.56
RX2  (via drill 0.38)
  Top 0.305: U1.13 29.53,40.49 28.17,41.85 28.17,50.74 v27.54,51.37
  Bottom 0.305: v27.54,51.37 27.54,63.44 20.68,70.29 U14.TX
RX3
  Top 0.305: U1.22 25.03,37.89 23.48,39.43 16.49,39.43 8.23,47.69 2.44,47.69 1.17,48.96 1.17,53.83 2.14,54.8 X2.3
SCK  (via drill 0.38)
  Top 0.305: U1.39 25.03,27.52 v20.93,23.43 | v7.73,20.51 6.43,20.51 J2.5
  Bottom 0.305: v20.93,23.43 18.01,20.51 v7.73,20.51
SCL  (via drill 0.38)
  Top 0.305: v17.89,32.96 18.14,33.21 U1.30
  Bottom 0.305: J3.3 24.24,42.23 17.89,35.88 v17.89,32.96
SDA  (via drill 0.38)
  Top 0.305: v17.84,31.94 17.96,31.94 18.73,32.71 U1.31
  Bottom 0.305: v17.84,31.94 17.45,31.94 17.07,32.32 17.07,35.95 22.97,41.85 22.97,44.89 23.73,45.66 25.89,45.66 26.78,44.77 J3.2
SWCLK  (via drill 0.38)
  Top 0.305: U1.37 24.03,28.68 23.22,27.88 v23.09,27.88
  Bottom 0.305: STM1.2 7.09,39.94 17.89,29.15 21.82,29.15 v23.09,27.88
SWDIO  (via drill 0.38)
  Top 0.305: U1.34 20.2,31.21 v19.16,30.16
  Bottom 0.305: STM1.3 5.31,42.48 17.63,30.16 v19.16,30.16
TX1  (via drill 0.38)
  Top 0.305: v25.13,25.46 25.13,26.1 26.53,27.5 U1.42
  Bottom 0.305: R15.1 41.64,24.28 26.27,24.28 25.21,25.34 25.21,25.37 v25.13,25.46
TX2  (via drill 0.38)
  Top 0.305: U1.12 31.15,35.71 31.17,35.72 31.48,35.72 v32.04,36.29
  Bottom 0.305: v32.04,36.29 32.04,61.47 23.22,70.29 U14.RX
TX3
  Top 0.305: U1.21 25.53,38.14 23.6,40.07 17.12,40.07 4.93,52.26 X2.2
TXD
  Bottom 0.305: U13.1 36.52,16.57 R16.2 R15.2
USB_D+  (via drill 0.38)
  Top 0.305: U1.33 19.56,31.71 18.45,30.59 13.01,30.59 12.93,30.67 v12.81,30.67 | J5.D+1 7.3,30.67 v7.35,30.62
  Bottom 0.305: v12.81,30.67 12.68,30.54 7.42,30.54 v7.35,30.62
USB_D-  (via drill 0.38)
  Top 0.305: U1.32 19.3,32.21 18.27,31.18 13.95,31.18 v13.7,31.43 | J5.D-1 8.85,31.32 v8.87,31.3
  Bottom 0.305: v8.87,31.3 9,31.43 v13.7,31.43
V_BCKP
  Bottom 0.508: B1.+ 48.7,6.43 C26.+ 43.81,6.43 C24.1 R39.1 35.71,6.45 U13.5
VCC
  Top 0.61: D10.2 D11.2
  Top 1.778: SW2.1 D10.2
VDDA
  Top 0.254: VDDA4.1 32.24,38.06 29.88,35.7 29.88,34.68 30.36,34.2 U1.9
  Top 0.305: L2.2 36.14,39.85 VDDA3.1 VDDA4.1 | U1.9
XANT
  Bottom 0.305: U13.11 R4.2 15.47,14.58 C17.1

### Text on the board
bPlace: 1,5 ADANA MERGEN | 02.06.2021 / 00:27 REV2.0